# EAGLE design plug-v19-delete-value (EAGLE 7.6.0)
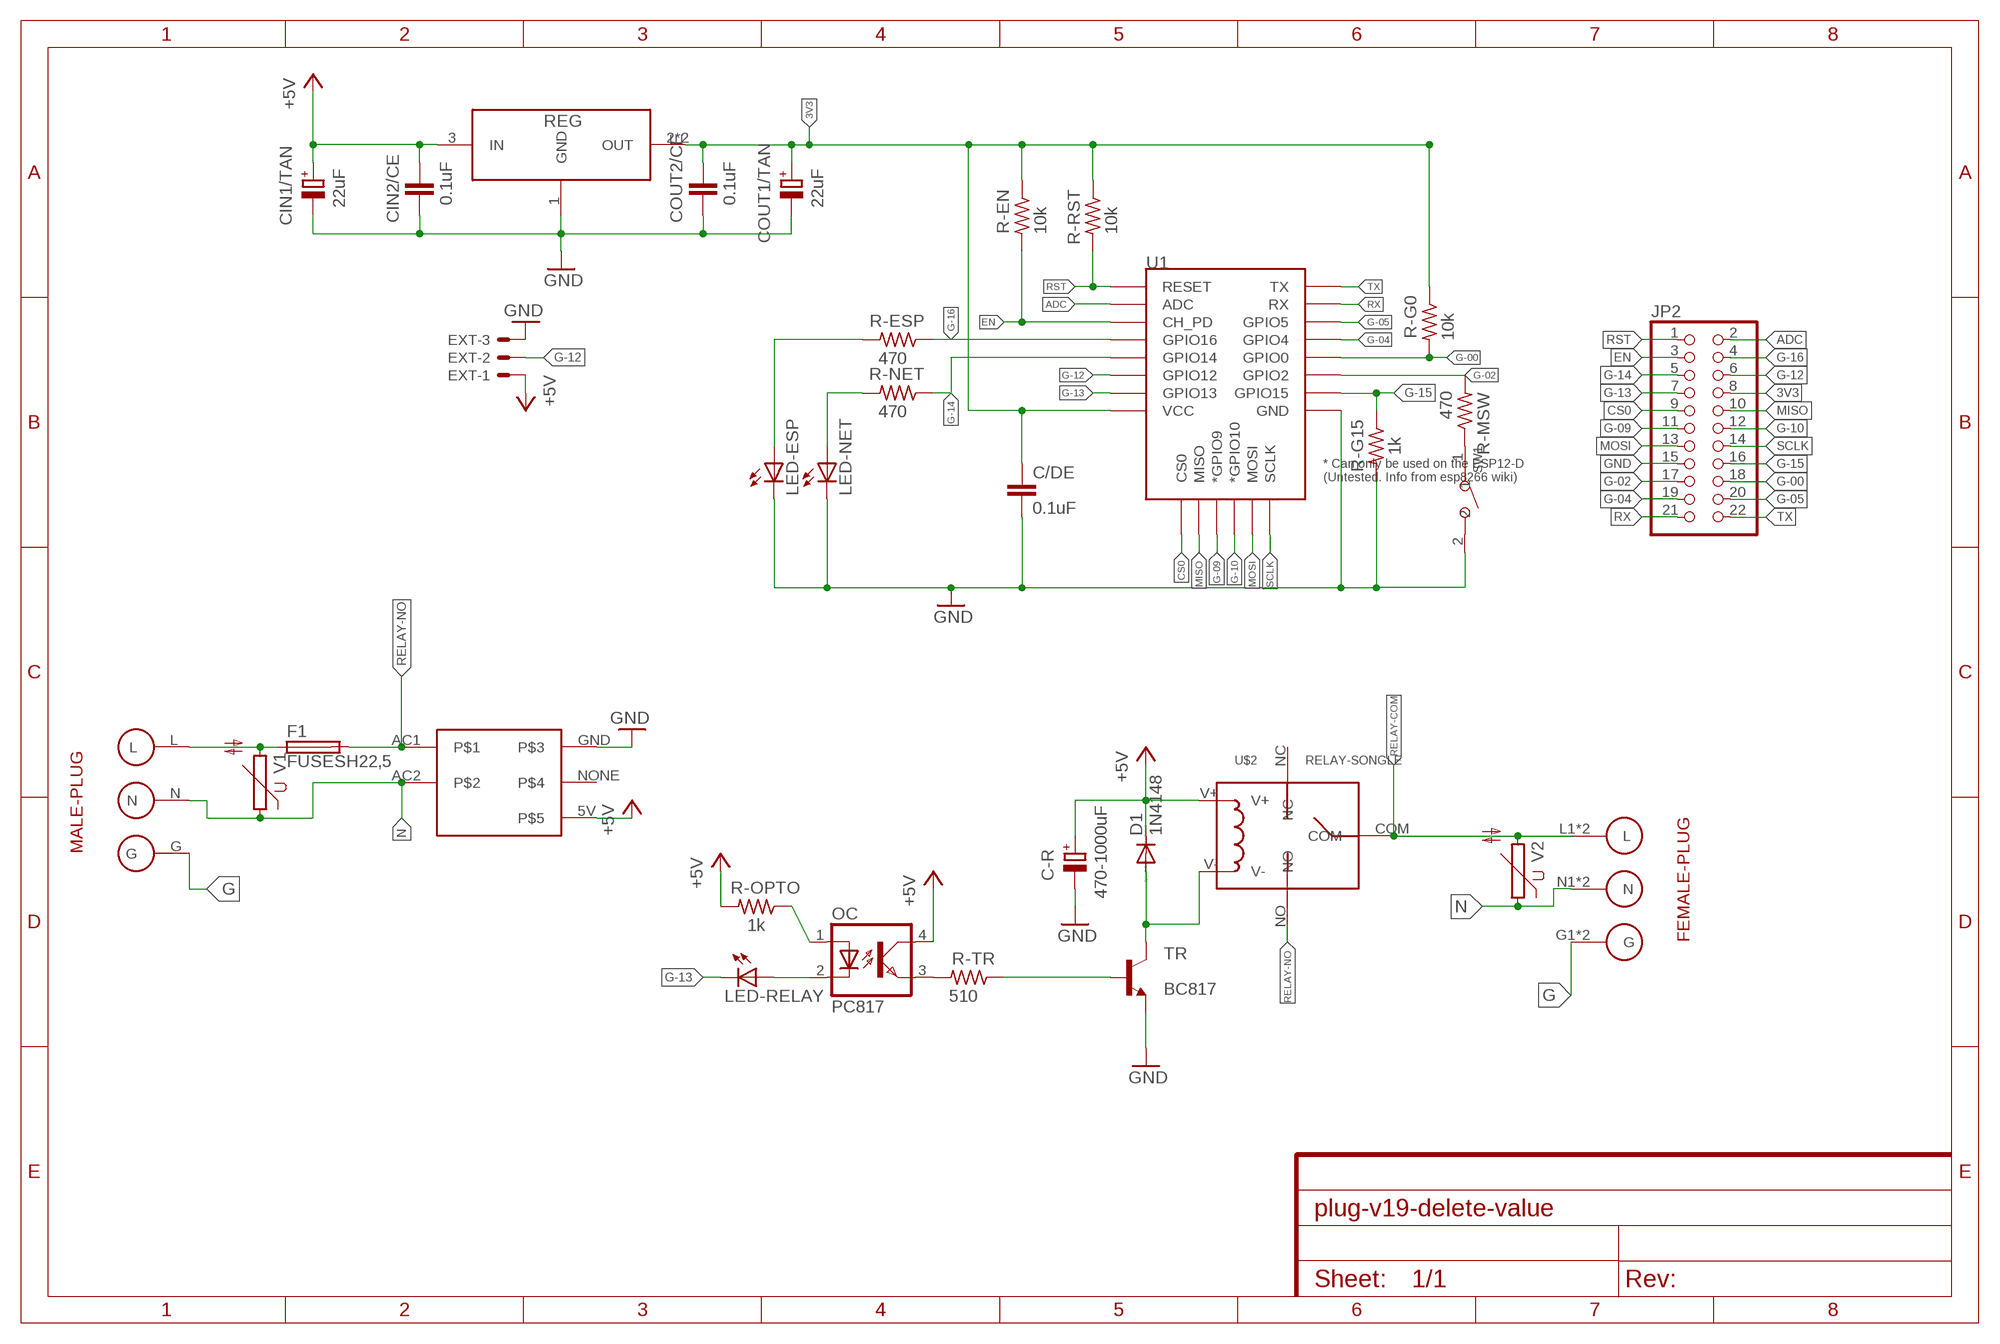
[diagram p0: schematic, sheet 1]

## Parts
C-R  470-1000uF  CPOL-EUE3.5-8  [E3,5-8]
C/DE  0.1uF  C-EUC0805  [C0805]
CIN1/TAN  22uF  CPOL-EUB/3528-21R  [B/3528-21R]
CIN2/CE  0.1uF  C-EUC0805K  [C0805K]
COUT1/TAN  22uF  CPOL-EUB/3528-21R  [B/3528-21R]
COUT2/CE  0.1uF  C-EUC0805K  [C0805K]
D1  1N4148  1N4148DO35-7  [DO35-7]
EXT  53048-03  [53048-03]
F1  FUSESH22,5  [SH22,5]
JP2  PINHD-2X11  [2X11]
LED-ESP  LEDCHIPLED_0805  [CHIPLED_0805]
LED-NET  LEDCHIPLED_0805  [CHIPLED_0805]
LED-RELAY  LEDCHIPLED_0805  [CHIPLED_0805]
OC  PC817  [DIL04]
R-EN  10k  R-US_M0805  [M0805]
R-ESP  470  R-US_M0805  [M0805]
R-G0  10k  R-US_M0805  [M0805]
R-G15  1k  R-US_M0805  [M0805]
R-MSW  470  R-US_M0805  [M0805]
R-NET  470  R-US_M0805  [M0805]
R-OPTO  1k  R-US_M0805  [M0805]
R-RST  10k  R-US_M0805  [M0805]
R-TR  510  R-US_M0805  [M0805]
REG  AMS1117-3.3  [SOT-223]
SW1  DIP-BUTTON(2P-6.0X3.0X4.3MM)-TS-1101F  [SW2-5.0-6.0X3.0X4.3MM]
TR  BC817  BC817-16SMD  [SOT23-BEC]
U1  ESP12ESMD  [ESP12E-SMD]
U$2  RELAY-SONGLE  [RELAY-SONGLE]
U$3  MALE-PLUG  [MALE-PLUG]
U$4  POWERSUPPLY-5V-700MA  [POWERSUPPLY-5V-700MA]
U$5  FEMALE-PLUG  [FEMALE-PLUG]
V1  S14K11  [S14K11]
V2  S14K11  [S14K11]

## Nets
3V3: C/DE.1 COUT1/TAN.+ COUT2/CE.1 JP2.8 R-EN.1 R-G0.1 R-RST.1 REG.2(OUT) REG.4(OUT) U1.VCC
+5V: C-R.+ CIN1/TAN.+ CIN2/CE.1 D1.C EXT.1 OC.4(COL) R-OPTO.2 REG.3(IN) U$2.V+ U$4.5V
ADC: JP2.2 U1.ADC
CS0: JP2.9 U1.CS0
EN: JP2.3 R-EN.2 U1.CH_PD
G: U$3.G U$5.G1(G) U$5.G2(G)
G-00: JP2.18 R-G0.2 U1.GPIO0
G-02: JP2.17 R-MSW.2 U1.GPIO2
G-04: JP2.19 U1.GPIO4
G-05: JP2.20 U1.GPIO5
G-09: JP2.11 U1.GPIO9(*GPIO9)
G-10: JP2.12 U1.GPIO10(*GPIO10)
G-12: EXT.2 JP2.6 U1.GPIO12
G-13: JP2.7 LED-RELAY.C U1.GPIO13
G-14: JP2.5 R-NET.1 U1.GPIO14
G-15: JP2.16 R-G15.1 U1.GPIO15
G-16: JP2.4 R-ESP.1 U1.GPIO16
GND: C-R.- C/DE.2 CIN1/TAN.- CIN2/CE.2 COUT1/TAN.- COUT2/CE.2 EXT.3 JP2.15 LED-ESP.C LED-NET.C R-G15.2 REG.1(GND) SW1.2 TR.E U1.GND U$4.GND
LINE: F1.1 U$3.L V1.2
MISO: JP2.10 U1.MISO
MOSI: JP2.13 U1.MOSI
N: U$3.N U$4.AC2 U$5.N1(N) U$5.N2(N) V1.1 V2.1
N$1: OC.3(EMIT) R-TR.2
N$2: R-TR.1 TR.B
N$6: LED-ESP.A R-ESP.2
N$13: OC.1(A) R-OPTO.1
N$16: LED-NET.A R-NET.2
N$17: D1.A TR.C U$2.V-
N$21: LED-RELAY.A OC.2(C)
N$22: R-MSW.1 SW1.1
RELAY-COM: U$2.COM U$5.L1(L) U$5.L2(L) V2.2
RELAY-NO: F1.2 U$2.NO U$4.AC1
RST: JP2.1 R-RST.2 U1.RESET
RX: JP2.21 U1.RXD0(RX)
SCLK: JP2.14 U1.SCLK
TX: JP2.22 U1.TXD0(TX)
Unconnected: U$2.NC U$4.NONE

## Library data of the parts
C-R CIN1/TAN COUT1/TAN = rcl:CPOL-EU: POLARIZED CAPACITOR, European symbol
C/DE CIN2/CE COUT2/CE = rcl:C-EU: CAPACITOR, European symbol
D1 = diode:1N4148: DIODE high speed (Philips)
EXT = con-molex:53?-03: CONNECTOR wire to board 1.25 mm (.049 inch) pitch header; MF: WALDOM/MOLEX; MPN: 53048-0310; OC_FARNELL: 9732918; OC_NEWARK: 38C9908
F1 = fuse:FUSE: Fuse; OC_FARNELL: unknown; OC_NEWARK: unknown
JP2 = pinhead:PINHD-2X11: PIN HEADER
LED-ESP LED-NET LED-RELAY = led:LED: LED OSRAM: - CHIPLED LG R971, LG N971, LY N971, LG Q971, LY Q971, LO R971, LY R971 LH N974, LH R974 LS Q976, LO Q976, LY Q976 LO Q996 - Hyper CHIPLED LW Q18S LB Q993, LB Q99A, LB R99A - SideLED LS A670, LO A670, LY A670, LG A670, LP A670 LB A673, LV A673, LT A673, LW A673 LH A674 LY A675 LS A676, LA A676, LO A676, LY A676, LW A676 LS A679, LY A679, LG A679 - Hyper Micro SIDELED® LS Y876, LA Y876, LO Y876, LY Y876 LT Y87S - SmartLED LW L88C, LW L88S LB L89C, LB L89S, LG L890 LS L89K, LO L89K, LY L89K LS L896, LA L896, LO L896, LY L896 - TOPLED LS T670, LO T670, LY T670, LG T670, LP T670 LSG T670, LSP T670, LSY T670, LOP T670, LYG T670 LG T671, LOG T671, LSG T671 LB T673, LV T673, LT T673, LW T673 LH T674 LS T676, LA T676, LO T676, LY T676, LB T676, LH T676, LSB T676, LW T676 LB T67C, LV T67C, LT T67C, LS T67K, LO T67K, LY T67K, LW E67C LS E67B, LA E67B, LO E67B, LY E67B, LB E67C, LV E67C, LT E67C LW T67C LS T679, LY T679, LG T679 LS T770, LO T770, LY T770, LG T770, LP T770 LB T773, LV T773, LT T773, LW T773 LH T774 LS E675, LA E675, LY E675, LS T675 LS T776, LA T776, LO T776, LY T776, LB T776 LHGB T686 LT T68C, LB T68C - Hyper Mini TOPLED® LB M676 - Mini TOPLED Santana® LG M470 LS M47K, LO M47K, LY M47K Source: http://www.osram.convergy.de LUXEON: - LUMILED® LXK2-PW12-R00, LXK2-PW12-S00, LXK2-PW14-U00, LXK2-PW14-V00 LXK2-PM12-R00, LXK2-PM12-S00, LXK2-PM14-U00 LXK2-PE12-Q00, LXK2-PE12-R00, LXK2-PE12-S00, LXK2-PE14-T00, LXK2-PE14-U00 LXK2-PB12-K00, LXK2-PB12-L00, LXK2-PB12-M00, LXK2-PB14-N00, LXK2-PB14-P00, LXK2-PB14-Q00 LXK2-PR12-L00, LXK2-PR12-M00, LXK2-PR14-Q00, LXK2-PR14-R00 LXK2-PD12-Q00, LXK2-PD12-R00, LXK2-PD12-S00 LXK2-PH12-R00, LXK2-PH12-S00 LXK2-PL12-P00, LXK2-PL12-Q00, LXK2-PL12-R00 Source: www.luxeon.com KINGBRIGHT: KA-3528ASYC Source: www.kingbright.com
OC = optocoupler:PC817: SHARP OPTO COUPLER; MPN: PC817X4J000F; OC_FARNELL: 9707727; OC_NEWARK: 97K7059
R-EN R-ESP R-G0 R-G15 R-MSW R-NET R-OPTO R-RST R-TR = rcl:R-US_: RESISTOR, American symbol
REG = AMS1117-3.3:AMS1117-3.3: 1A LOW DROPOUT VOLTAGE REGULATOR
SW1 = Seeed-OPL-Switch:DIP-BUTTON(2P-6.0X3.0X4.3MM): 311020025
TR = transistor-npn:BC817*: NPN Transistor
U1 = esp8266modules:ESP12E: ESP12E Module
U$2 = Relay-Songle:RELAY-SONGLE
U$3 = Male-Female-PLUG:MALE-PLUG
U$4 = PowerSupply-5V-700mA:POWERSUPPLY-5V-700MA
U$5 = Male-Female-PLUG:FEMALE-PLUG
V1 V2 = varistor:S14K11: VARISTOR

## Board
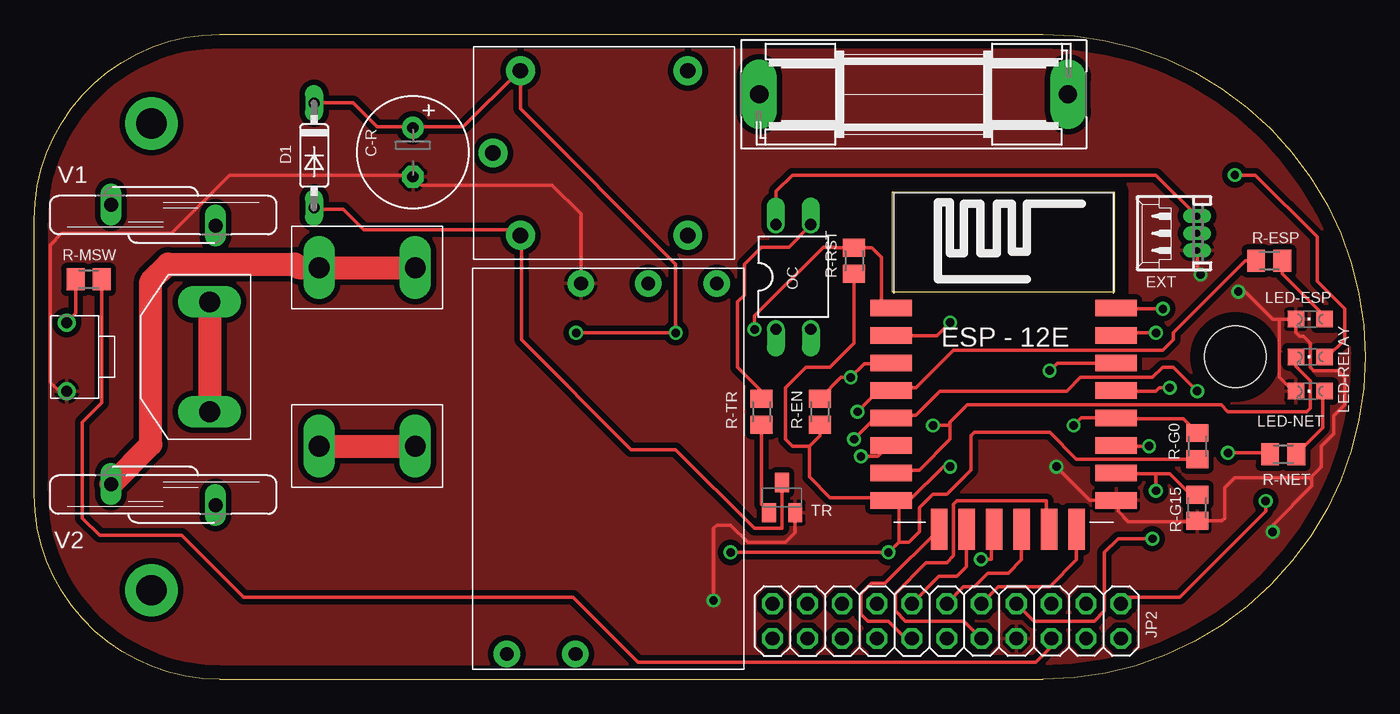
[diagram p1: board, top side]
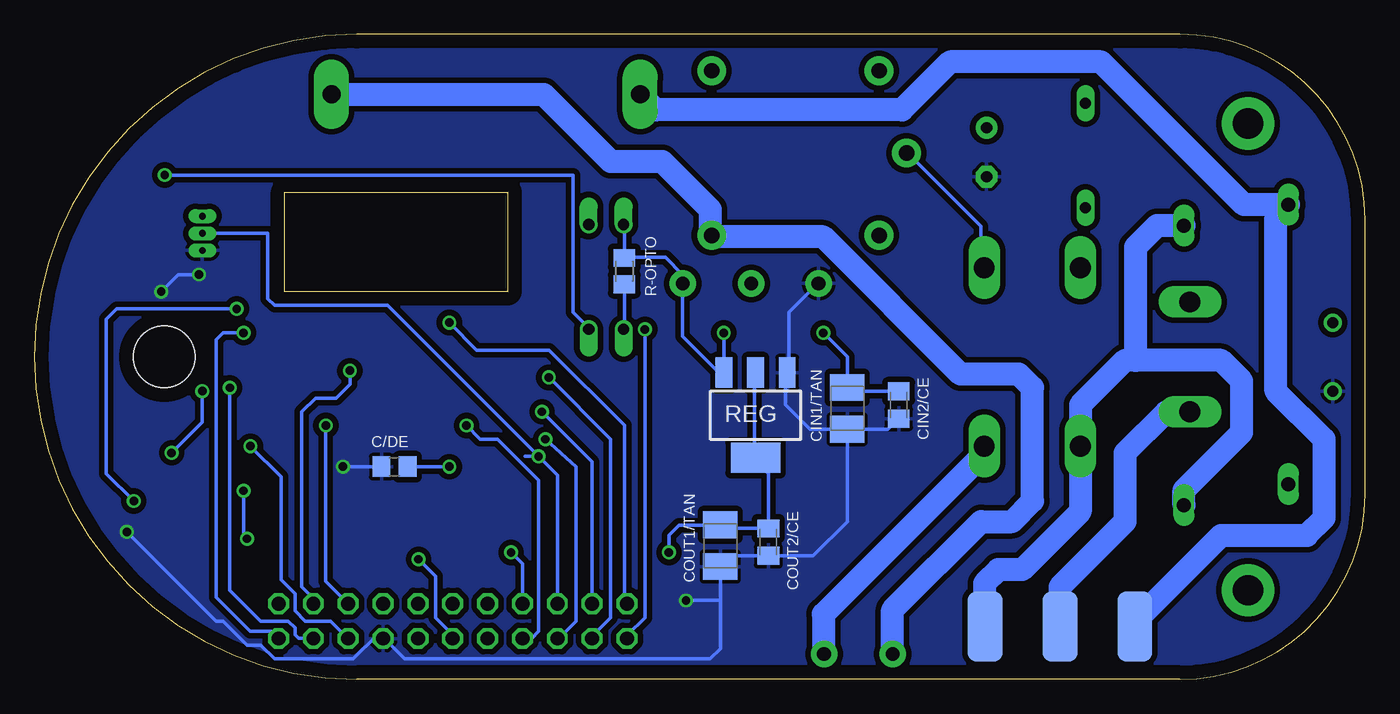
[diagram p2: board, bottom side, seen from below]

Size 97 x 47 mm. Coordinates in mm from the lower left corner, seen from the top.
Outline: 13.5,0 73.5,0 arc180 73.5,47 13.5,47 arc90 0,33.5 0,13.5 arc90 13.5,0
Outline: 62.5,35.5 62.5,28.25 78.75,28.25 78.75,35.5 62.5,35.5
Copper layers (1*16): Top 0.035mm / dielectric 1.5mm / Bottom 0.035mm
Design rules "default": minimum track width 10mil, minimum drill 24mil, track to track 8mil, track to pad 8mil, pad to pad 8mil, via to via 8mil, smd to smd 8mil, copper to edge 40mil, drill to drill 8mil, minimum pad ring 10mil, minimum via ring 8mil, stop-mask expansion 4mil, vias tented up to drill 0mil, thermal gap 10mil
Holes 4.5 mm at 87.54,23.5

### Footprints (pad centres in the part's own frame; a part is rotated, then mirrored left to right if it is on the bottom)
E3,5-8 = drill 0.813 pad 1.6: + -1.778,0 | drill 0.813 pad 1.6 octagon: - 1.778,0
C0805 = smd 1.3 x 1.5: 1 -0.95,0; 2 0.95,0
B/3528-21R = smd 1.95 x 2.5: + 1.525,0; - -1.525,0
C0805K = smd 1.3 x 1.6: 1 -1,0; 2 1,0
DO35-7 = drill 0.813 long: A 3.81,0; C -3.81,0
53048-03 = drill 0.5 pad 0.698 long: 1 1.25,-1.25; 2 0,-1.25; 3 -1.25,-1.25
SH22,5 = drill 1.321 pad 2.54 long: 1 -11.252,0; 2 11.252,0
2X11 = drill 1.016 octagon: 1 -12.7,-1.27; 2 -12.7,1.27; 3 -10.16,-1.27; 4 -10.16,1.27; 5 -7.62,-1.27; 6 -7.62,1.27; 7 -5.08,-1.27; 8 -5.08,1.27; 9 -2.54,-1.27; 10 -2.54,1.27; 11 0,-1.27; 12 0,1.27; 13 2.54,-1.27; 14 2.54,1.27; 15 5.08,-1.27; 16 5.08,1.27; 17 7.62,-1.27; 18 7.62,1.27; 19 10.16,-1.27; 20 10.16,1.27; 21 12.7,-1.27; 22 12.7,1.27
CHIPLED_0805 = smd 1.2 x 1.2: A 0,-1.05; C 0,1.05
DIL04 = drill 0.813 offset: 1 -1.27,-3.81; 2 1.27,-3.81; 3 1.27,3.81; 4 -1.27,3.81
M0805 = smd 1.3 x 1.6: 1 -0.95,0; 2 0.95,0
SOT-223 = smd 1.219 x 2.235: 1 -2.381,-3.099; 2 -0.07,-3.099; 3 2.241,-3.099 | smd 3.6 x 2.2: 4 -0.07,3.099
SW2-5.0-6.0X3.0X4.3MM = drill 0.8 pad 1.27: 1 -2.5,0; 2 2.5,0
SOT23-BEC = smd 1 x 1.4: B -0.95,-1.1; C 0,1.1; E 0.95,-1.1
ESP12E-SMD = smd 3 x 1.2: ADC -8.3,3.8; CH_PD -8.3,1.8; GND 8.1,-8.2; GPIO0 8.1,-2.2; GPIO2 8.1,-4.2; GPIO4 8.1,-0.2; GPIO5 8.1,1.8; GPIO12 -8.3,-4.2; GPIO13 -8.3,-6.2; GPIO14 -8.3,-2.2; GPIO15 8.1,-6.2; GPIO16 -8.3,-0.2; RESET -8.3,5.8; RXD0 8.1,3.8; TXD0 8.1,5.8; VCC -8.3,-8.2 | smd 1.2 x 3: CS0 -4.8,-10.3; GPIO9 -0.8,-10.3; GPIO10 1.2,-10.3; MISO -2.8,-10.3; MOSI 3.2,-10.3; SCLK 5.2,-10.3
RELAY-SONGLE = drill 1.118 pad 2.1: COM -8.1,0; NC 6.1,6; NO 6.1,-6; V+ -6.1,6; V- -6.1,-6
MALE-PLUG = smd 5.08 x 2.54: G 0,0; L 0,5.46; N 0,-5.46
POWERSUPPLY-5V-700MA = drill 1 pad 1.93: 5V 13.5,-7.9; AC1 -13.5,7.4; AC2 -13.5,2.4; GND 13.5,2; NONE 13.5,-2.9
FEMALE-PLUG = drill 1.524 long: G1 -6.73,4; G2 -6.73,-4; L1 1.27,6.5; L2 8.27,6.5; N1 1.27,-6.5; N2 8.27,-6.5
S14K11 = drill 1.016 long: 1 -0.762,-3.81; 2 0.762,3.81

### Placement (x,y rotation side)
C-R  27.59,38.41 270 top
C/DE  70.75,15.5 180 bottom
CIN1/TAN  37.75,19.75 90 bottom
CIN2/CE  34,20 270 bottom
COUT1/TAN  47,9.75 90 bottom
COUT2/CE  43.5,10 270 bottom
D1  20.39,38.17 270 top
EXT  83.5,32.5 90 top
F1  64.09,42.63 0 top
JP2  66.5,4.25 0 top
LED-ESP  93,26.25 90 top
LED-NET  93,21 90 top
LED-RELAY  93,23.5 90 top
OC  55.32,29.33 0 top
R-EN  57.25,19.5 90 top
R-ESP  90,30.5 0 top
R-G0  84.75,17 90 top
R-G15  84.75,12.5 270 top
R-MSW  3.96,29.14 0 top
R-NET  91.02,16.39 0 top
R-OPTO  54,29.75 90 bottom
R-RST  59.75,30.5 90 top
R-TR  53,19.5 90 top
REG  44.5,19.25 180 bottom
SW1  2.35,23.5 270 top
TR  54.5,13.25 0 top
U1  70.75,21.25 0 top
U$2  41.53,38.35 0 top
U$3  22.25,3.85 270 bottom
U$4  41.84,15.35 90 top
U$5  19.5,23.5 0 top
V1  9.4,33.83 90 top
V2  9.4,13.46 90 top

### Tracks (layer width: path | path; a pad name or v marks a point on that pad's centre or on a via)
3V3  (via drill 0.61)
  Top 0.254: 63,13.05 U1.VCC 62.25,13.25 58,13.25 56.5,14.75 56.5,17 | 84.75,16 R-G0.1 75.95,16.05 74,18 68.5,18 68.25,17.75 68.25,15.25 66.5,13.5 65.5,13.5 64.5,12.5 64.5,10.75 63.75,10 63,10 | 63,10 v62.25,9.25 v50.75,9.25 | 63,10 63,13.05 | R-RST.1 59.75,24.5 58,22.75 56.25,22.75 54.75,21.25 54.75,17.5 55.25,17 56.5,17 | 56.5,17 57.25,17.75 R-EN.1 | 63,13.05 63.8,13.05 66.25,15.5 v66.75,15.5
  Bottom 0.254: v66.75,15.5 C/DE.1 | COUT1/TAN.+ 47,11 COUT2/CE.1 43.5,15 44.5,16 REG.4 44.5,16.25 44.5,22.25 REG.2 | 47,11.25 COUT1/TAN.+ | JP2.8 61.42,8.42 v62.25,9.25 | v50.75,9.25 50.75,10.5 50,11.25 47.02,11.25 COUT1/TAN.+
+5V  (via drill 0.61)
  Top 0.254: EXT.1 81.75,36.75 55.25,36.75 54.05,35.55 OC.4 | v39.5,25.25 v46.75,25.25 46.75,30.25 35.43,41.57 U$2.V+ 35.25,44.25 31.25,40.25 27.75,40.25 C-R.+ 27.5,40.25 25,40.25 23.25,42 20.41,42 D1.C
  Bottom 0.254: R-OPTO.2 54,33 OC.4 | CIN2/CE.1 37.75,21 CIN1/TAN.+ 37.75,23.5 v39.5,25.25 | 54,30.5 R-OPTO.2 | R-OPTO.2 53.95,30.75 51,30.75 49.74,29.49 U$4.5V 49.75,25 47.1,22.35 REG.3 v46.74,25.24 v46.75,25.25
ADC  (via drill 0.61)
  Top 0.254: 62.25,25 U1.ADC 65.8,25.05 v66.75,26
  Bottom 0.254: JP2.2 54,6 54,18.5 59.5,24 64.75,24 v66.75,26
CS0
  Top 0.254: U1.CS0 62,7 61,7 60.25,6.25 60.25,4.75 60.75,4.25 62.25,4.25 63.52,2.98 JP2.9
EN  (via drill 0.61)
  Top 0.254: U1.CH_PD 62.25,23 60.5,23 v59.5,22 58.8,22 R-EN.2
  Bottom 0.254: v59.5,22 55,17.5 55,4.5 56.25,3.25 JP2.3
G
  Top 1.676: U$5.G1 U$5.G2
  Bottom 1.676: U$5.G2 14.5,19.5 17.5,16.5 17.5,11.5 22.25,6.75 U$3.G
G-00  (via drill 0.61)
  Top 0.254: R-G0.2 84.75,18 83.75,19 79,19 U1.GPIO0 | 78.75,19 U1.GPIO0 | v75.75,18.5 76.3,19.05 U1.GPIO0
  Bottom 0.254: JP2.18 75.75,7.15 v75.75,18.5
G-02  (via drill 0.61)
  Top 0.254: v81.25,17 79,17 U1.GPIO2 | JP2.17 74.12,2.37 73,1.25 44,1.25 39.25,6 15.25,6 10.75,10.5 4.75,10.5 3.5,11.75 3.5,18.75 4.91,20.16 R-MSW.2
  Bottom 0.254: JP2.17 75.39,4.25 77.25,4.25 78,5 78,6.25 79,7.25 79,14.75 v81.25,17
G-04  (via drill 0.61)
  Top 0.254: U1.GPIO4 79,21 81.75,21 82,21.25 v82.75,21.25
  Bottom 0.254: JP2.19 76.68,3 77.75,3 78,3.25 78,3.75 78.5,4.25 80.5,4.25 82.75,6.5 v82.75,21.25
G-05  (via drill 0.61)
  Top 0.254: 79,23 U1.GPIO5 74.55,23.05 v74,22.5
  Bottom 0.254: JP2.20 76.75,6 77.5,6.75 77.5,19.5 76.5,20.5 75,20.5 74,21.5 v74,22.5
G-09  (via drill 0.61)
  Top 0.254: v69,8.75 69.75,8.75 69.75,10.75 U1.GPIO9
  Bottom 0.254: v69,8.75 67.75,7.5 67.75,4.5 66.5,3.25 JP2.11
G-10
  Top 0.254: JP2.12 67.73,6.75 68.5,6.75 69.5,7.75 71,7.75 71.95,8.7 U1.GPIO10
G-12  (via drill 0.61)
  Top 0.254: v60.25,16.25 61.5,16.25 62.25,17 U1.GPIO12
  Bottom 0.254: EXT.2 80,32.5 80,27.75 79.5,27.25 71.25,27.25 v60.25,16.25 | 61.25,16.25 v60.25,16.25 | JP2.6 58.88,14.88 v60.25,16.25
G-13  (via drill 0.61)
  Top 0.254: 92,23.5 LED-RELAY.C 91.95,22.8 93,21.75 93,19.75 92.75,19.5 87,19.5 86.5,20 68,20 66.75,18.75 66.75,18.5 | U1.GPIO13 62.5,15.25 64.5,15.25 66.75,17.5 66.75,18.5 | v65.5,18.5 66.75,18.5
  Bottom 0.254: JP2.7 60.77,2.98 60.25,3.5 60.25,14.5 63.25,17.5 64.5,17.5 v65.5,18.5
G-14  (via drill 0.61)
  Top 0.254: v87,16.5 90,16.5 R-NET.1 | v59.75,17.5 61.3,19.05 U1.GPIO14 62.5,19.25 64.25,19.25 66,21 75.25,21 76.25,22 81.5,22 82.25,22.75 83,22.75 v84.75,21
  Bottom 0.254: JP2.5 58.52,3.23 57.5,4.25 57.5,15.5 v59.75,17.5 | v87,16.5 84.75,18.75 v84.75,21
G-15  (via drill 0.61)
  Top 0.254: 81.75,15 79,15 U1.GPIO15 | R-G15.1 84.75,13.5 84.25,13.5 82.75,15 81.75,15 | JP2.16 72.85,4.25 77.25,4.25 78,5 78,9.25 79,10.25 v81.5,10.25 | v81.75,13.75 81.75,15
  Bottom 0.254: v81.5,10.25 81.75,10.5 v81.75,13.75
G-16  (via drill 0.61)
  Top 0.254: v60,19.5 61.5,21 62.25,21 U1.GPIO16 62.5,21.25 64.25,21.25 67,24 82.25,24 83,24.75 83,25.25 88.25,30.5 R-ESP.1
  Bottom 0.254: v60,19.5 56.34,15.84 JP2.4
GND  (via drill 0.61)
  Top 0.254: v74.5,15.5 76.95,13.05 U1.GND 79,13 79,12.25 79.75,11.5 84.7,11.5 | 90.75,26.25 LED-ESP.C 91.95,25.3 92.25,25 92.5,25 93,24.5 93,22.75 93.25,22.5 95,22.5 95.5,22 95.5,20 94.7,19.2 94.7,17.9 93.8,17 93.8,15.5 93.1,14.8 93.1,14.5 | 90.75,26.25 90.25,26.25 88.25,28.25 v87.75,28.25 | LED-NET.C 91.75,21 90.75,22 90.75,26.25 | 55.5,12 TR.E 55.45,10.7 54.75,10 52,10 50.75,11.25 49.75,11.25 49.5,11 v49.5,5.75 | 85,11.75 84.75,11.75 R-G15.2 86.55,11.55 86.75,11.75 86.75,13.95 87.5,14.7 92.9,14.7 93.1,14.5 | EXT.3 84.75,29.75 v85,29.5 | U$4.GND 39.84,33.91 37.75,36 28.22,36 C-R.- 27.5,36.75 14.25,36.75 10,32.5 2,32.5 1.15,31.65 1.15,21.65 1.8,21 SW1.2 | v90.25,10.75 90.25,11.25 93.1,14.1 93.1,14.5
  Bottom 0.254: v74.5,15.5 C/DE.2 | CIN1/TAN.- 37.75,11.5 40.25,9 COUT2/CE.2 47,9 COUT1/TAN.- 47,5.75 | U$4.GND 40,28.75 42,26.75 42,22.5 REG.1 42.25,22.22 42.25,20 40.48,18.23 CIN1/TAN.- | JP2.15 71.5,3 70,1.5 47.75,1.5 47,2.25 47,5.75 | v85,29.5 86.5,29.5 v87.75,28.25 | JP2.15 71.58,3.17 | JP2.15 72.02,3.23 73.75,1.5 79.5,1.5 80.5,2.5 81.5,2.5 83.25,4.25 83.75,4.25 v90.25,10.75 | v49.5,5.75 47,5.75 | CIN1/TAN.- 34.77,18.23 CIN2/CE.2
  pour Top (isolate 0.406): 0,0 97,0 97,47 0,47
  pour Bottom (isolate 0.406): 0,0 97,0 97,47 0,47
LINE
  Bottom 1.676: U$3.L 16.79,4.21 10.5,10.5 4.25,10.5 3,11.75 3,17.5 6.5,21 6.5,33.68 V1.2 8.84,34.59 19.25,45 30.25,45 33.75,41.5 51.71,41.5 F1.1
MISO
  Top 0.254: JP2.10 65.94,7.5 67.25,7.5 67.95,8.2 U1.MISO
MOSI
  Top 0.254: U1.MOSI 73.75,11 73.75,13 67.25,13 67,12.75 67,9 66.5,8.5 65,8.5 62.75,6.25 62.75,5 63.5,4.25 67.77,4.25 JP2.13
N
  Top 1.676: U$5.N1 U$5.N2
  Bottom 1.676: U$5.N2 27.77,16.48 39.5,4.75 39.5,1.91 U$4.AC2 | U$3.N 27.75,3.89 27.75,7 26.75,8 25,8 20.77,12.23 U$5.N1 20.75,17.02 20.75,20 17.5,23.25 16.75,23.25 | V2.1 13.21,13.79 9,18 9,21.75 10.5,23.25 16.75,23.25 | V1.1 15.18,33.07 16.75,31.5 16.75,23.25
N$1
  Top 0.254: OC.3 56.5,33 55,31.5 53,31.5 51.75,30.25 51.75,28 51.25,27.5 51.25,22.75 53,21 R-TR.2
N$2
  Top 0.254: TR.B 53.5,12.25 53,12.75 R-TR.1
N$3  (via drill 2.2 pad 3.81)
  other vias: 8.54,6.5
N$4  (via drill 2.2 pad 3.81)
  other vias: 8.54,40.5
N$6
  Top 0.254: LED-ESP.A 94,26.25 94,26.5 90.95,29.55 R-ESP.2
N$13
  Bottom 0.254: R-OPTO.1 54,25.75 OC.1
N$16
  Top 0.254: 92,16.5 R-NET.2 93.9,18.32 93.9,21 LED-NET.A
N$17
  Top 0.254: TR.C 54.5,11 52.5,11 46.75,16.75 43.5,16.75 35.5,24.75 35.5,32.25 U$2.V- 35.25,32.5 35,32.75 24,32.75 22.5,34.25 20.5,34.25 D1.A
N$21  (via drill 0.61)
  Top 0.254: LED-RELAY.A 94.25,23.5 95.5,24.75 95.5,27 93.5,29 93.5,32.25 89,36.75 v87.5,36.75
  Bottom 0.254: v87.5,36.75 57.75,36.75 57.75,26.75 56.75,25.75 OC.2
N$22
  Top 0.254: R-MSW.1 3.01,26.66 SW1.1
RELAY-COM
  Top 1.676: U$5.L2 U$5.L1 19.25,30 19,30.25 9.75,30.25 8.5,29 8.5,17.13 V2.2
  Bottom 0.254: U$2.COM 33.25,38.25 28,33 28,30 U$5.L2
RELAY-NO
  Bottom 1.676: U$4.AC1 34.44,5.06 28,11.5 25.75,11.5 24.25,13 24.25,21.25 25.25,22.25 29.5,22.25 39.5,32.25 47.53,32.25 U$2.NO 47.75,32.47 47.75,34.25 51.25,37.75 55,37.75 59.88,42.63 F1.2
RST  (via drill 0.61)
  Top 0.254: U1.RESET 62.25,27 61.75,27.5 61.75,30.75 61.05,31.45 R-RST.2 58.45,31.45 58.4,31.5 57.5,31.5 52.5,26.5 v52.5,25.5
  Bottom 0.254: v52.5,25.5 52.5,4.5 53.75,3.25 JP2.1
RX  (via drill 0.61)
  Top 0.254: U1.RXD0 79,25.25 v81.75,25.25
  Bottom 0.254: JP2.21 79.72,3.5 81.25,3.5 83.75,6 83.75,24.75 83.25,25.25 v81.75,25.25
SCLK
  Top 0.254: JP2.14 70.27,6.75 74,6.75 75.95,8.7 U1.SCLK
TX  (via drill 0.61)
  Top 0.254: v82.25,27 79,27 U1.TXD0 | JP2.22 79.68,6 83.5,6 89.75,12.25 v89.75,13
  Bottom 0.254: v82.25,27 91,27 91.75,26.25 91.75,15 v89.75,13